# Altium schematic sheet Schematic.SchDoc
size A; DocumentNumber: 1; SheetNumber: 1; SheetTotal: 1
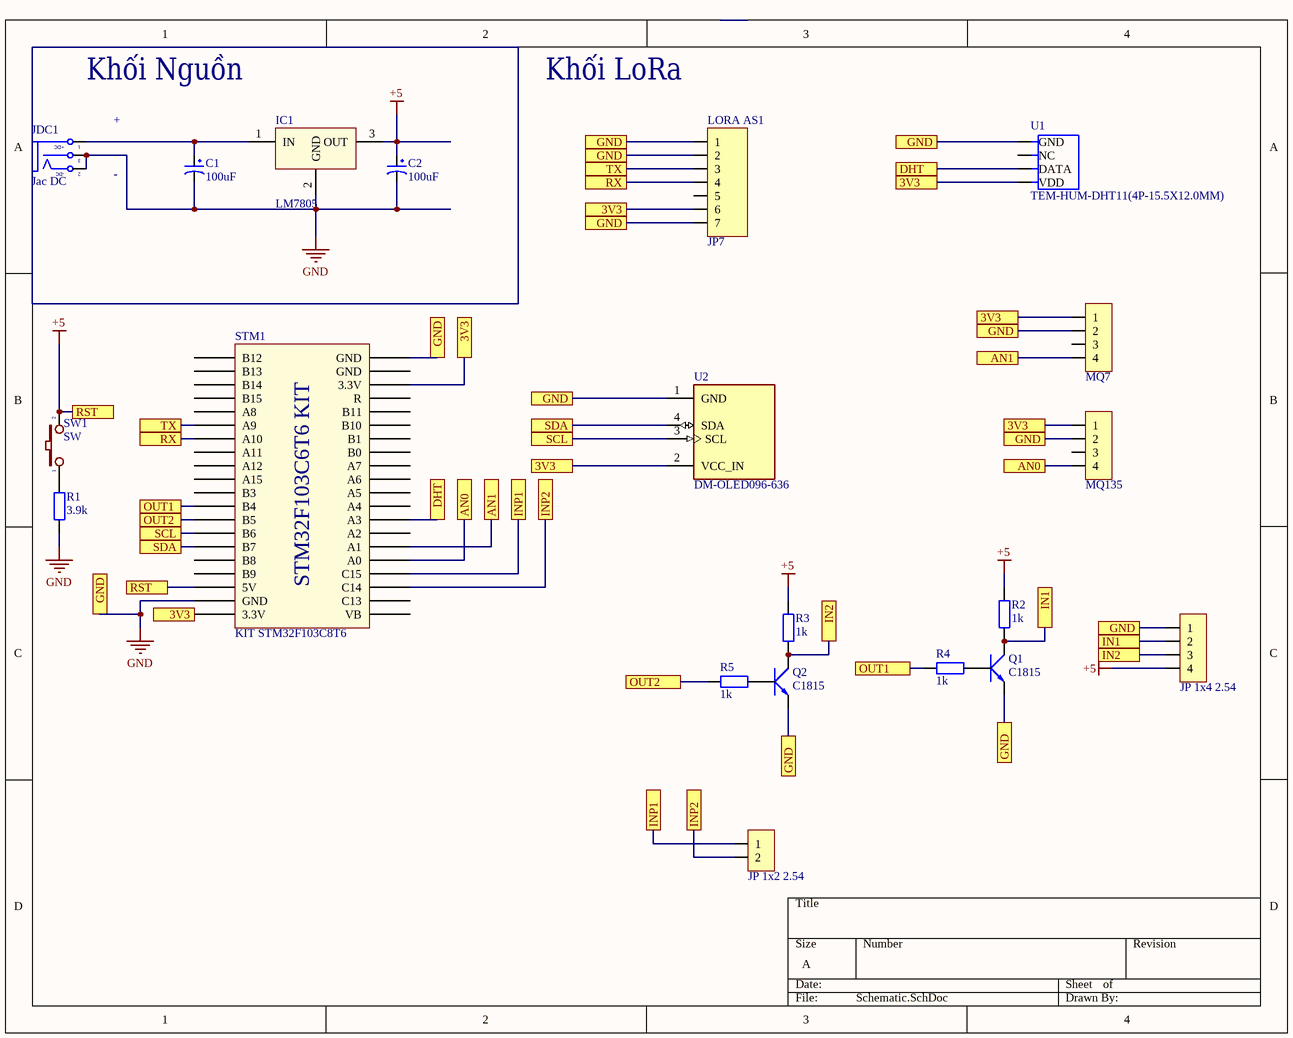
[diagram p0: Schematic.SchDoc]

## Parts
C1  100uF  [Tu hoa 10mm]
C2  100uF  [Tu hoa 10mm]
IC1  LM7805  [QTO-220]
JDC1  Jac DC  [DC-IN]
JP1  JP 1x4 2.54  [JP 1x4 CC]
JP2  JP 1x2 2.54  [JP 1x2 CC]
LORA_AS1  JP7  [JP7-C1C]
MQ1  MQ7  [JP 1x4 CC]
MQ2  MQ135  [JP 1x4 CC]
Q1  C1815  [TO92]
Q2  C1815  [TO92]
R1  3.9k  [tro vach 1/4w]
R2  1k  [tro vach 1/4w]
R3  1k  [tro vach 1/4w]
R4  1k  [tro vach 1/4w]
R5  1k  [tro vach 1/4w]
STM1  KIT STM32F103C8T6  [STM32F103 KIT]
SW1  SW  [SW2]
U1  TEM-HUM-DHT11(4P-15.5X12.0MM)  [SNR4-2.54-15.5X12.0X5.5MM]
U2  DM-OLED096-636  [MODULE_DM-OLED096-636]

## Ports
3V3, AN0, AN1, DHT, GND, IN1, IN2, INP1, INP2, OUT1, OUT2, RST, RX, SCL, SDA, TX

## Nets
+5: C2.1 IC1.3(OUT) JP1.4 R2.2 R3.2 STM1.18(5V) SW1.2 ; port RST
GND: C1.2 C2.2 IC1.2(GND) JDC1.2(TN) JDC1.3(S) JP1.1 LORA_AS1.1 LORA_AS1.2 LORA_AS1.7 MQ1.2 MQ2.2 Q1.1(E) Q2.1(E) R1.1 STM1.19(GND) STM1.40(GND) U1.4(GND) U2.1(GND) ; port GND
3V3: LORA_AS1.6 MQ1.1 MQ2.1 STM1.20(3.3V) STM1.38(3.3V) U1.1(VDD) U2.2(VCC_IN) ; port 3V3
AN0: MQ2.4 STM1.25(A0) ; port AN0
AN1: MQ1.4 STM1.26(A1) ; port AN1
DHT: STM1.28(A3) U1.2(DATA) ; port DHT
IN1: JP1.2 Q1.2(C) R2.1 ; port IN1
IN2: JP1.3 Q2.2(C) R3.1 ; port IN2
INP1: JP2.1 STM1.24(C15) ; port INP1
INP2: JP2.2 STM1.23(C14) ; port INP2
OUT1: R4.1 STM1.12(B4) ; port OUT1
OUT2: R5.1 STM1.13(B5) ; port OUT2
RX: LORA_AS1.4 STM1.7(A10) ; port RX
SCL: STM1.14(B6) U2.3(SCL) ; port SCL
SDA: STM1.15(B7) U2.4(SDA) ; port SDA
TX: LORA_AS1.3 STM1.6(A9) ; port TX
NetC1_1: C1.1 IC1.1(IN) JDC1.1(T)
NetQ1_3: Q1.3(B) R4.2
NetQ2_3: Q2.3(B) R5.2
NetR1_2: R1.2 SW1.1

Not connected (* = marked no-connect by the designer): LORA_AS1 5; MQ1 3; MQ2 3; STM1 1(B12) 2(B13) 3(B14) 4(B15) 5(A8) 8(A11) 9(A12) 10(A15) 11(B3) 16(B8) 17(B9) 21(VB) 22(C13) 27(A2) 29(A4) 30(A5) 31(A6) 32(A7) 33(B0) 34(B1) 35(B10) 36(B11) 37(R) 39(GND); U1 3(NC)

## Notes on the sheet
- Khối Nguồn
- Khối LoRa
- (near JDC1) +
- (near JDC1) -
- (in symbol DCIN) +DC; -DC
- (in symbol STM32f103 Bluepill) STM32F103C6T6 KIT

## Library data of the parts
C1 C2 = Tu Hoa 100uF 100V 10x20: Cắm; Don_Vi: Con; So_Chan: 2; Ten_Linh_Kien: Tụ Hóa 100uF 100V 10x20MM; Ma_Hang: MH003150; Chung_Loai: Cắm; Kieu_Chan: *
IC1 = LM78xx: On ap +, from + 5 to + 24VDC; Value: LM7805
JDC1 = DCIN: Jac DC input; Value: Jac DC
JP1 MQ1 MQ2 = JP 1x4 2.54 Cai Cong: Cắm; Ten_Linh_Kien: Jump Đơn Cái 2.54MM 1x40P Cong; Don_Vi: Con; Ma_Hang: MH001265; Ghi_Chu: *; Kieu_Chan: *; Chung_Loai: Cắm
JP2 = JP 1x2 2.54 Cai Cong: Cắm; Ten_Linh_Kien: Jump Đơn Cái 2.54MM 1x40P Cong; Don_Vi: Con; Ma_Hang: MH001265; Ghi_Chu: *; Kieu_Chan: *; Chung_Loai: Cắm
LORA_AS1 = JP7: WR-PHD 2.54 mm Angled Socket Header; Manufacturer: W¨¹rth Elektronik eiSos GmbH; partNo: 613007143121; ComponentLink1 Description: Manufacturer; ComponentLink2 Description: Datasheet; NoPins: 07; Created Date: 29 March 2013; ComponentLink1URL: http://www.we-online.com; ComponentLink2URL: http://katalog.we-online.de/em/datasheet/6130xx143121.pdf; Created by: Karrer Zheng
Q1 Q2 = Trans C1815 DIP: NPN transistor; Value: C9014
R1 = Tro Vach 1/4W 5% 9.1k: Cắm; Don_Vi: Con; So_Chan: 2; Ten_Linh_Kien: Trở Vạch 1/4w 5% 9.1k; Ma_Hang: MH008787; Chung_Loai: Cắm; Kieu_Chan: *
R2-R5 = Tro Vach 1/4W 5% 1k: Cắm; Don_Vi: Con; So_Chan: 2; Ten_Linh_Kien: Trở Vạch 1/4w 5% 1k; Ma_Hang: MH007390; Chung_Loai: Cắm; Kieu_Chan: *
STM1 = STM32f103 Bluepill: KIT STM32F103C8T6 Bluepill
SW1 = SW2: Switch button 2 pin; Value: SW chip 2 pin
U1 = TEM-HUM-DHT11(4P-15.5X12.0MM): Servo AC 100 ~ 120VAC Supply 10A 120V Load; MP: DHT11; MF: Panasonic Industrial Automation Sales; Package: None; SnapEDA_Link: https://www.snapeda.com/parts/DHT11/Panasonic/view-part/6618018/?ref=snap; Check_prices: https://www.snapeda.com/parts/DHT11/Panasonic/view-part/6618018/?ref=eda; Availability: In Stock; Value: *; Price: None; Purchase-URL: https://pricing.snapeda.com/search/part/DHT11/?ref=eda
U2 = DM-OLED096-636: 0.96â€ 128 X 64 MONOCHROME GRAPHIC OLED DISPLAY MODULE - I2C; SnapEDA_Link: https://www.snapeda.com/parts/DM-OLED096-636/Display+Module/view-part/?ref=snap; Package: Package; Value: *; MF: Display Module; MP: DM-OLED096-636; Check_prices: https://www.snapeda.com/parts/DM-OLED096-636/Display+Module/view-part/?ref=eda